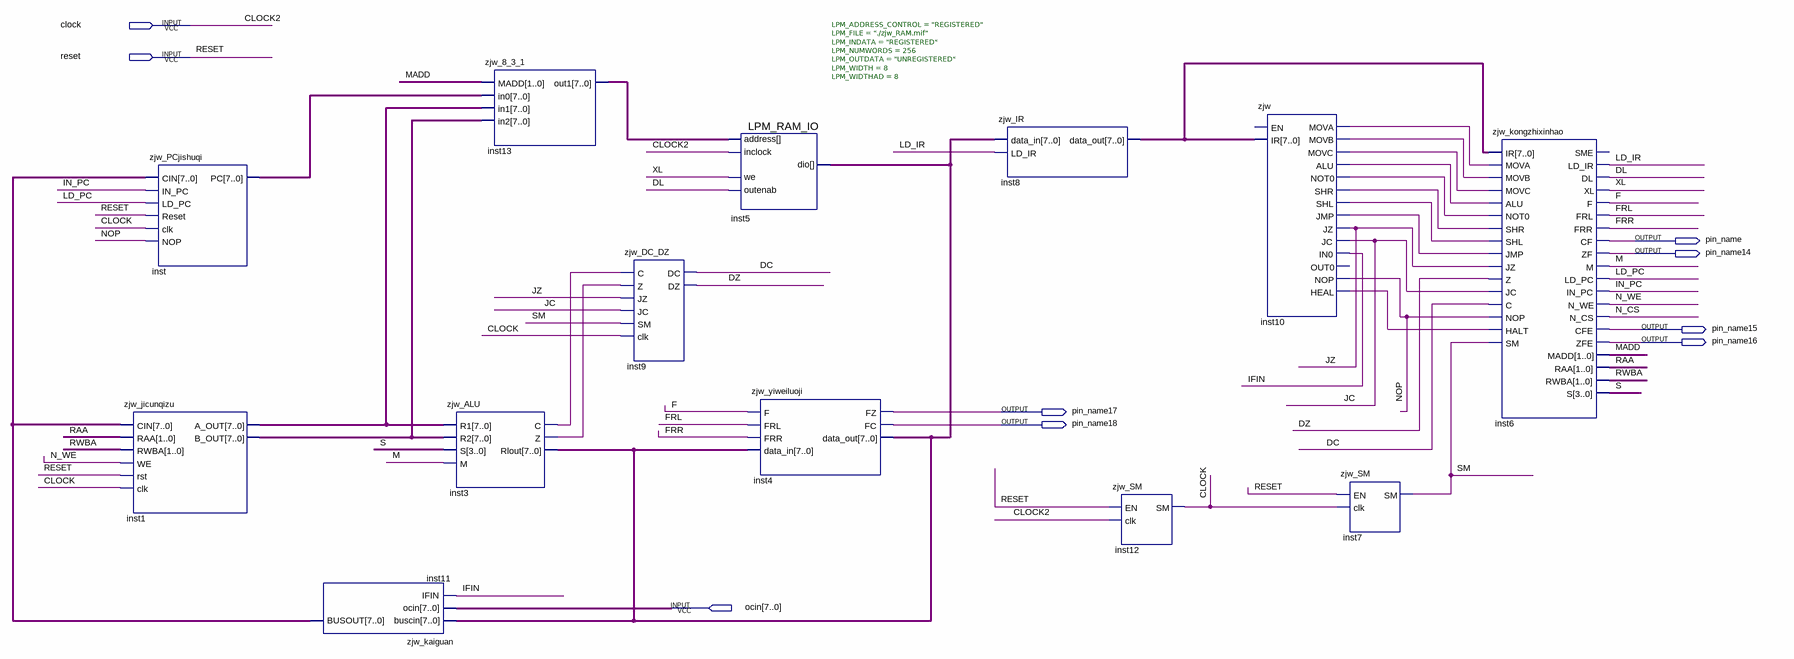
[diagram p0: schematic sheet]
// Quartus schematic zjw_CPU.bdf as structural Verilog: 13 symbols, 9 pins
module zjw_CPU (
  input  clock,
  input  reset,
  input  [7:0] ocin,
  output pin_name,
  output pin_name14,
  output pin_name15,
  output pin_name16,
  output pin_name17,
  output pin_name18
);

  wire DC, DL, DZ, F, FRL, FRR, IFIN, IN_PC, inst3_c, inst3_z, inst10_alu, inst10_heal, inst10_jmp,
       inst10_mova, inst10_movb, inst10_movc, inst10_not0, inst10_shl, inst10_shr, JC, JZ, LD_IR, LD_PC, M,
       MADD, N_CS, N_WE, NOP, RAA, RWBA, S, SM, XL;
  wire [7:0] inst1_a_out, inst1_b_out, inst3_rlout, inst8_data_out, inst11_busout, inst13_out1, inst_pc;

  zjw_jicunqizu inst1 (
    .CIN(inst11_busout), .RAA({2{RAA}}), .RWBA({2{RWBA}}), .WE(N_WE), .rst(reset), .clk(clock),
    .A_OUT(inst1_a_out), .B_OUT(inst1_b_out));
  zjw_PCjishuqi inst (
    .CIN(inst11_busout), .IN_PC(IN_PC), .LD_PC(LD_PC), .Reset(reset), .clk(clock), .NOP(NOP), .PC(inst_pc));
  zjw_kaiguan inst11 (.buscin(inst3_rlout), .ocin(ocin), .IFIN(IFIN), .BUSOUT(inst11_busout));
  zjw_8_3_1 inst13 (.MADD({2{MADD}}), .in0(inst_pc), .in1(inst1_a_out), .in2(inst1_b_out), .out1(inst13_out1));
  zjw_ALU inst3 (.R1(inst1_a_out), .R2(inst1_b_out), .S({4{S}}), .M(M), .C(inst3_c), .Z(inst3_z), .Rlout(inst3_rlout));
  zjw_DC_DZ inst9 (.C(inst3_c), .Z(inst3_z), .JZ(JZ), .JC(JC), .SM(SM), .clk(clock), .DC(DC), .DZ(DZ));
  LPM_RAM_IO #(.LPM_ADDRESS_CONTROL("REGISTERED"), .LPM_FILE("./zjw_RAM.mif"), .LPM_INDATA("REGISTERED"), .LPM_NUMWORDS(256), .LPM_OUTDATA("UNREGISTERED"), .LPM_WIDTH(8), .LPM_WIDTHAD(8)) inst5 (
    .address(inst13_out1), .inclock(clock), .we(XL), .outenab(DL), .dio(inst3_rlout));
  zjw_yiweiluoji inst4 (
    .F(F), .FRL(FRL), .FRR(FRR), .data_in(inst3_rlout), .FZ(pin_name17), .FC(pin_name18),
    .data_out(inst3_rlout));
  zjw_IR inst8 (.data_in(inst3_rlout), .LD_IR(LD_IR), .data_out(inst8_data_out));
  zjw_SM inst12 (.EN(reset), .clk(clock), .SM(clock));
  zjw inst10 (
    .IR(inst8_data_out), .MOVA(inst10_mova), .MOVB(inst10_movb), .MOVC(inst10_movc), .ALU(inst10_alu),
    .NOT0(inst10_not0), .SHR(inst10_shr), .SHL(inst10_shl), .JMP(inst10_jmp), .JZ(JZ), .JC(JC), .IN0(IFIN),
    .NOP(NOP), .HEAL(inst10_heal));  // open: EN, OUT0
  zjw_SM inst7 (.EN(reset), .clk(clock), .SM(SM));
  zjw_kongzhixinhao inst6 (
    .IR(inst8_data_out), .MOVA(inst10_mova), .MOVB(inst10_movb), .MOVC(inst10_movc), .ALU(inst10_alu),
    .NOT0(inst10_not0), .SHR(inst10_shr), .SHL(inst10_shl), .JMP(inst10_jmp), .JZ(JZ), .Z(DZ), .JC(JC),
    .C(DC), .NOP(NOP), .HALT(inst10_heal), .SM(SM), .LD_IR(LD_IR), .DL(DL), .XL(XL), .F(F), .FRL(FRL),
    .FRR(FRR), .CF(pin_name), .ZF(pin_name14), .M(M), .LD_PC(LD_PC), .IN_PC(IN_PC), .N_WE(N_WE), .N_CS(N_CS),
    .CFE(pin_name15), .ZFE(pin_name16), .MADD(MADD), .RAA(RAA), .RWBA(RWBA), .S(S));  // open: SME

  // Other names for the same wires on the sheet: CLOCK2 = clock
endmodule
